# EasyEDA Pro project ProProject_PressureSensor_2023-10-08.epro, board PCB1
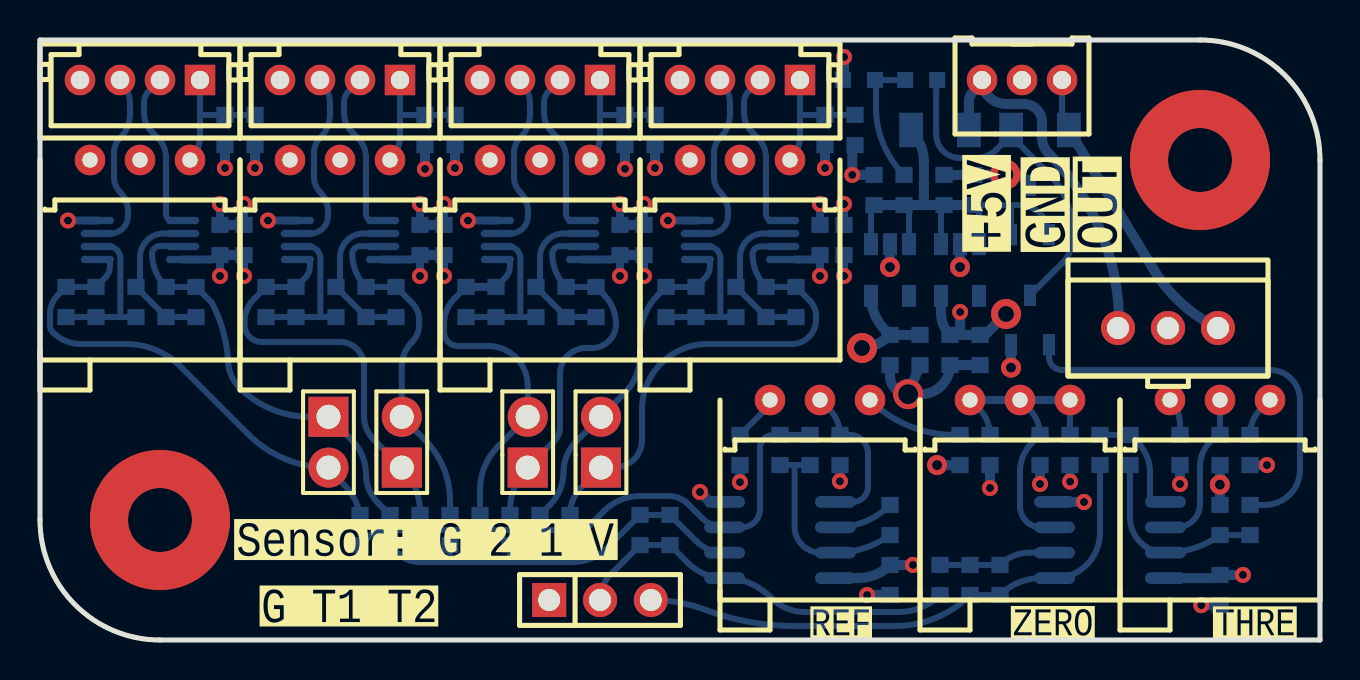
[diagram p7: board, top side]
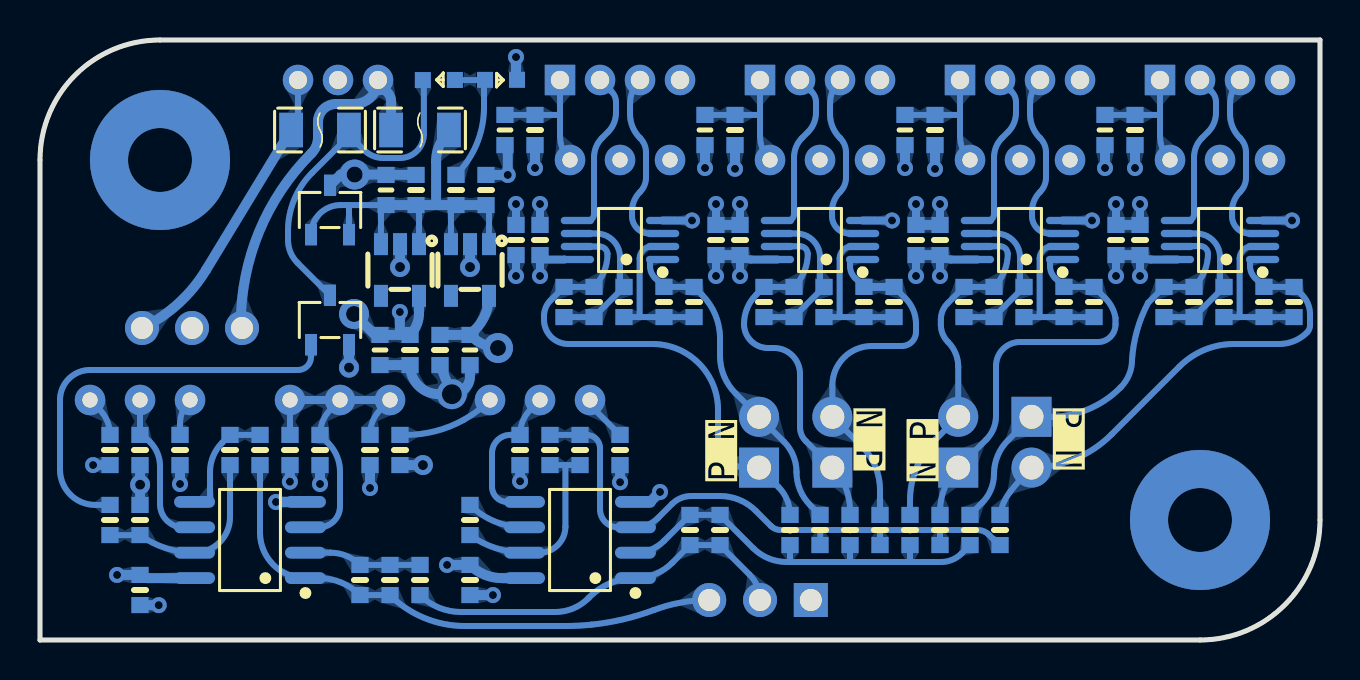
[diagram p8: board, bottom side, seen from below]

Outline 64 x 30 mm; copper layers: Top Layer, Inner1, Inner2, Bottom Layer. Coordinates in mm from the lower left corner of the outline.
Outline path: 0,6 0,30 58,30 arc(62.24,28.24) 64,24 64,0 6,0 arc(1.76,1.76) 0,6
Stack: Top Layer 0.035mm / Dielectric1 0.48mm PP er 4.5 / Inner1 0.035mm / Dielectric2 0.48mm FR4 er 4.5 / Inner2 0.035mm / Dielectric3 0.48mm PP er 4.5 / Bottom Layer 0.035mm

## Design rules (mm)
template: 自定义配置
spacing copperThickness1oz (default): track to track 0.102, other pairs 0.152 to 0.3
spacing copperThickness2oz: track to track 0.203, other pairs 0.152 to 0.3
track width copperThickness1oz (default): min 0.127, default 0.254, max 2.54
track width copperThickness2oz: min 0.203, default 0.254, max 2.54
differential pair differentialPair (default): width min 0.127, default 0.254, max 2.54; gap min 0.152, default 0.152
via viaSize (default): diameter min 0.5, default 0.61, max 10; hole min 0.3, default 0.305, max 6.3
net GND uses innerPlaneGND

## Placement (name value [footprint] x y rotation side)
C1  22uF  [R0603]  46.7 22.5 270 bottom
C2  10nF C0G  [R0603]  45.2 22.5 90 bottom
C3  1uF  [R0603]  41.7 22.5 90 bottom
C4  22uF  [R0603]  42.5 14.5 90 bottom
C5  10nF C0G  [R0603]  44 14.5 270 bottom
C7  22uF  [R0603]  47 14.5 90 bottom
C8  10nF C0G  [R0603]  45.5 14.5 270 bottom
C9  22uF  [R0603]  10.75 25.5 90 bottom
C10  100p  [R0603]  31.5 5.5 90 bottom
C11  100p  [R0603]  1.3 16.9 90 bottom
C12  100p  [R0603]  38.5 9.5 90 bottom
C13  100p  [R0603]  7.8 16.9 270 bottom
C14  100p  [R0603]  46.5 3 90 bottom
C15  100p  [R0603]  59 6 90 bottom
C16  1uF  [R0603]  40 9.5 90 bottom
C17  1uF  [R0603]  50 9.5 90 bottom
C18  1uF  [R0603]  59 9.5 90 bottom
C19  22uF  [R0603]  20.75 25.5 90 bottom
C20  100p  [R0603]  11.3 16.9 90 bottom
C21  100p  [R0603]  17.8 16.9 270 bottom
C22  10nF C0G  [R0603]  9 20 270 bottom
C23  10nF C0G  [R0603]  19 20 270 bottom
C24  10nF C0G  [R0603]  29 20 270 bottom
C25  10nF C0G  [R0603]  39 20 270 bottom
C26  10nF C0G  [R0603]  42.5 3 90 bottom
C27  10nF C0G  [R0603]  59 2.5 90 bottom
C28  22uF  [R0603]  30.75 25.5 90 bottom
C29  100p  [R0603]  21.3 16.9 90 bottom
C30  22uF  [R0603]  40.75 25.5 90 bottom
C31  100p  [R0603]  31.3 16.9 90 bottom
C32  100p  [R0603]  27.8 16.9 270 bottom
C33  100p  [R0603]  37.8 16.9 270 bottom
C34  10nF C0G  [R0603]  40.2 20 270 bottom
C35  10nF C0G  [R0603]  30.2 20 270 bottom
C36  10nF C0G  [R0603]  20.2 20 270 bottom
C37  10nF C0G  [R0603]  10.2 20 270 bottom
CN1  HDGC2001WV-4P  [CONN-TH_4P-P2.00_HDGC_HDGC2001WV-4P]  5 28 180 top
CN2  HDGC2001WV-4P  [CONN-TH_4P-P2.00_HDGC_HDGC2001WV-4P]  15 28 180 top
CN3  HDGC2001WV-4P  [CONN-TH_4P-P2.00_HDGC_HDGC2001WV-4P]  25 28 180 top
CN4  HDGC2001WV-4P  [CONN-TH_4P-P2.00_HDGC_HDGC2001WV-4P]  35 28 180 top
CN5  HC-XHB-3A  [CONN-TH_3P-P2.50_HC-XHB-3A]  56.4 15.6 0 top
F1  nSMD020-30V  [F1206]  45 25.5 180 bottom
F2  nSMD020-30V  [F1206]  50 25.5 180 bottom
H2  PZ254V-11-03P  [HDR-TH_3P-P2.54-V-M]  28 2 0 top
H5  PZ254V-11-02P  [HDR-TH_2P-P2.54-V-M]  14.42 9.89 270 top
H6  PZ254V-11-02P  [HDR-TH_2P-P2.54-V-M]  24.38 9.89 90 top
H7  PZ254V-11-02P  [HDR-TH_2P-P2.54-V-M]  28.05 9.89 90 top
H8  PZ254V-11-02P  [HDR-TH_2P-P2.54-V-M]  18.09 9.89 90 top
LED3  -  [LED_0603]  41 28 0 bottom
LED4  -  [LED_0603]  44.01 28.01 180 bottom
P1  PH-3A  [CONN-TH_12P-P2.00-H-W4.8_PH-3A]  49.1 28 270 top
Q1  S8050  [SOT-23-3_L2.9-W1.6-P1.90-LS2.8-BR]  49.5 16 270 bottom
R2  500  [R0603]  16 5.5 90 bottom
R3  15K  [R0603]  30 5.5 90 bottom
R4  500  [R0603]  19 5.5 90 bottom
R5  50  [RES-ADJ-TH_3P-L10.0-W10.0-P2.50-L]  5 24 0 top
R6  50  [R0603]  9.25 25.5 270 bottom
R7  500  [R0603]  22 5.5 90 bottom
R8  2K  [R0603]  2.8 16.9 90 bottom
R9  500  [R0603]  25 5.5 90 bottom
R10  500  [R0603]  17.5 5.5 90 bottom
R11  120  [R0603]  4.8 16.9 270 bottom
R12  500  [R0603]  20.5 5.5 90 bottom
R13  500  [R0603]  23.5 5.5 90 bottom
R14  2K  [R0603]  45 3 90 bottom
R15  2K  [R0603]  6.3 16.9 270 bottom
R16  500  [R0603]  26.5 5.5 90 bottom
R17  15K  [R0603]  37 9.5 90 bottom
R18  2K  [R0603]  48 3 90 bottom
R19  2K  [R0603]  53 9.5 90 bottom
R20  50K  [R0603]  54.5 9.5 90 bottom
R21  2K  [R0603]  46 9.5 270 bottom
R22  2K  [R0603]  42.5 6 90 bottom
R23  15K  [R0603]  51.5 9.5 270 bottom
R24  10K  [R0603]  60.5 9.5 270 bottom
R25  10K  [RES-ADJ-TH_3P-L10.0-W10.0-P2.50-L]  39 12 0 top
R26  10K  [RES-ADJ-TH_3P-L10.0-W10.0-P2.50-L]  49 12 0 top
R27  10K  [RES-ADJ-TH_3P-L10.0-W10.0-P2.50-L]  59 12 0 top
R28  5K  [R0603]  60.5 6 270 bottom
R29  2K  [R0603]  35 9.5 90 bottom
R30  5K  [R0603]  47.5 9.5 90 bottom
R31  10K  [R0603]  57 9.5 90 bottom
R33  50  [RES-ADJ-TH_3P-L10.0-W10.0-P2.50-L]  15 24 0 top
R34  50  [R0603]  19.25 25.5 270 bottom
R35  2K  [R0603]  12.8 16.9 90 bottom
R36  120  [R0603]  14.8 16.9 270 bottom
R37  2K  [R0603]  16.3 16.9 270 bottom
R38  50  [RES-ADJ-TH_3P-L10.0-W10.0-P2.50-L]  25 24 0 top
R39  50  [R0603]  29.25 25.5 270 bottom
R40  50  [RES-ADJ-TH_3P-L10.0-W10.0-P2.50-L]  35 24 0 top
R41  2K  [R0603]  22.8 16.9 90 bottom
R42  50  [R0603]  39.25 25.5 270 bottom
R43  2K  [R0603]  32.8 16.9 90 bottom
R44  120  [R0603]  24.8 16.9 270 bottom
R45  120  [R0603]  34.8 16.9 270 bottom
R46  2K  [R0603]  26.3 16.9 270 bottom
R47  2K  [R0603]  36.3 16.9 270 bottom
R48  10K  [R0603]  43.2 22.5 270 bottom
TV1  ESDA5V3L  [SOT-23-3_L2.9-W1.6-P1.90-LS2.8-BR]  49.5 21.5 270 bottom
U1  LP5907MFX-4.5/NOPB  [TSOT-23-5_L2.9-W1.6-P0.95-LS2.8-BR]  42.5 18.5 90 bottom
U2  LP5907MFX-4.5/NOPB  [TSOT-23-5_L2.9-W1.6-P0.95-LS2.8-BR]  46 18.5 90 bottom
U3  TLV2333IDGKR  [VSSOP-8_L3.0-W3.0-P0.65-LS5.0-BL]  5 20 90 bottom
U4  TLV2333IDGKR  [SOIC-8_L4.9-W3.9-P1.27-LS6.0-BL]  37 5 90 bottom
U5  TLV2333IDGKR  [SOIC-8_L4.9-W3.9-P1.27-LS6.0-BL]  53.5 5 90 bottom
U6  TLV2333IDGKR  [VSSOP-8_L3.0-W3.0-P0.65-LS5.0-BL]  15 20 90 bottom
U7  TLV2333IDGKR  [VSSOP-8_L3.0-W3.0-P0.65-LS5.0-BL]  25 20 90 bottom
U8  TLV2333IDGKR  [VSSOP-8_L3.0-W3.0-P0.65-LS5.0-BL]  35 20 90 bottom

## Footprints (pads in the part's own frame, mm; a bottom-side part is the same pattern mirrored in y, then rotated)
CONN-TH_3P-P2.50_HC-XHB-3A
  round 1.7 hole 1.1: 1(-2.5,0) 2(0,0) 3(2.5,0)
CONN-TH_4P-P2.00_HDGC_HDGC2001WV-4P
  rect 1.524x1.524 hole 0.914: 1(-3,0)
  round 1.524 hole 0.914: 2(-1,0) 3(1,0) 4(3,0)
CONN-TH_12P-P2.00-H-W4.8_PH-3A
  round 1.524 hole 0.9: 1(0,2) 2(0,0) 3(0,-2)
F1206
  rect 1.19x1.728 smd: 1(-1.445,0) 2(1.445,0)
HDR-TH_2P-P2.54-V-M
  rect 2x2 hole 1.2: 1(-1.27,0)
  round 2 hole 1.2: 2(1.27,0)
HDR-TH_3P-P2.54-V-M
  rect 1.7x1.7 hole 1.1: 1(-2.54,0)
  round 1.7 hole 1.1: 2(0,0) 3(2.54,0)
LED_0603
  rect 0.8x0.8 smd: 1(-0.851,-0.01) 2(0.75,-0.005)
R0603
  rect 0.806x0.864 smd: 1(-0.753,0) 2(0.753,0)
RES-ADJ-TH_3P-L10.0-W10.0-P2.50-L
  round 1.524 hole 0.762: 1(-2.5,0) 2(0,0) 3(2.5,0)
SOIC-8_L4.9-W3.9-P1.27-LS6.0-BL
  oval 0.588x2.045 smd: 1(-1.905,-2.772) 2(-0.635,-2.772) 3(0.635,-2.772) 4(1.905,-2.772) 5(1.905,2.772) 6(0.635,2.772) 7(-0.635,2.772) 8(-1.905,2.772)
SOT-23-3_L2.9-W1.6-P1.90-LS2.8-BR
  rect 1.07x0.6 smd: 1(1.235,-0.95) 2(1.235,0.95) 3(-1.235,0)
TSOT-23-5_L2.9-W1.6-P0.95-LS2.8-BR
  rect 1.1x0.7 smd: 1(1.294,-0.951) 2(1.294,-0.001) 3(1.294,0.951) 4(-1.294,0.951) 5(-1.294,-0.949)
VSSOP-8_L3.0-W3.0-P0.65-LS5.0-BL
  oval 0.364x1.662 smd: 1(-0.975,-2.131) 2(-0.325,-2.131) 3(0.325,-2.131) 4(0.975,-2.131) 5(0.975,2.131) 6(0.325,2.131) 7(-0.325,2.131) 8(-0.975,2.131)

## Nets
As in the schematic, except:
$1N32985: R24.1 R27.3
$1N32987: R27.1 R31.2
$1N32997: C18.2 R27.2 U5.6

Pads without a net: U1 4; U2 4

## Via types
v1: diameter 7, hole 3.2, Top Layer to Bottom Layer, 2 vias
v2: diameter 0.8, hole 0.4, Top Layer to Bottom Layer, 43 vias
v3: diameter 1, hole 0.5, Top Layer to Bottom Layer, 5 vias
v4: diameter 1.5, hole 0.8, Top Layer to Bottom Layer, 3 vias
v5: diameter 1.5, hole 1, Top Layer to Bottom Layer, 1 via

## Routing (per net, layer and track width the routed paths; a pad name or vN(x,y) marks a point on that pad's centre or on a via; arc(x,y) is an arc through that point)
GND: length 52.5
  Bottom Layer w0.4: v2(30.2,21.8) C35.1 ; v2(39,21.8) C25.1 ; v2(19,21.8) C23.1 ; v2(1.4,20.97) U3.4 ; v2(10.2,21.8) C37.1 ; v2(29,21.8) C24.1 ; v2(11.4,20.97) U6.4 ; v2(20.2,21.8) C36.1 ; v2(40.2,21.8) C34.1 ; v2(9,21.8) C22.1 ; v2(31.4,20.97) U8.4 ; v2(21.4,20.97) U7.4
  Bottom Layer w0.5: C28.1 v2(30.75,23.6) ; C15.2 59,6.76 v3(59,7.76) 59,8.74 C18.1 ; v2(58.06,1.74) 58.91,1.74 58.95,1.7 ; C7.1 C8.2 arc(45.07,12.72) 44.04,12.29 v5(43.41,12.29) ; U1.2 v3(42.5,18.65) ; C9.1 v2(10.75,23.6) ; v2(50,7.8) C17.1 ; C24.1 C35.1 ; C4.1 42.5,13.2 arc(42.77,12.56) v5(43.41,12.29) ; C23.1 C36.1 ; 40,8.7 40,8.7 v2(40,7.94) ; C26.1 v2(41.35,2.25) ; C5.2 v5(43.41,12.29) ; U5.4 50.73,6.9 v2(52.2,6.9) ; v2(33,7.4) 33.5,6.9 34.22,6.9 U4.4 ; Q1.2 v3(48.55,13.62) ; v2(57,7.8) R31.1 ; 40.2,28 v2(40.2,29.15) ; v2(47.5,7.6) R30.1 ; C22.1 C37.1 ; TV1.3 48.96,23.27 v4(48.27,23.27) C2.2 ; v2(35,7.89) 35,8.65 ; C19.1 v2(20.75,23.6) ; C3.2 v2(40.61,23.25) 40.61,24.61 C30.1 ; U2.2 v3(46,18.65)
VCC: length 32.1
  Bottom Layer w0.4: v2(19,18.2) C23.2 arc(18.75,19.08) 18.46,19.03 U6.8 ; U7.8 28.46,19.03 arc(28.75,19.08) C24.2 v2(29,18.2) ; U3.8 8.46,19.03 arc(8.75,19.08) C22.2 v2(9,18.2) ; v2(10.2,18.2) C37.2 ; v2(30.2,18.2) C35.2 ; 38.87,19.03 37.78,19.03 ; v2(20.2,18.2) C36.2 ; v2(39,18.2) C25.2 ; v2(40.2,18.2) C34.2
  Bottom Layer w0.5: C4.2 42.26,15.49 arc(41.74,16.28) U1.5 ; C4.2 C5.1 ; C4.2 42.47,15.23 arc(41.84,14.79) v4(41.1,14.6) ; C24.2 C35.2 ; U4.8 40.91,3.09 arc(41.77,3.27) C26.2 v2(43.65,3.75) ; C23.2 C36.2 ; v2(60.15,3.25) C27.2 arc(58.82,3.14) 58.62,3.09 U5.8 ; C37.2 C22.2
VCCREF: length 13.8
  Bottom Layer w0.5: R6.2 v2(9.25,23.6) ; R21.2 v3(44.85,8.75) ; 19.25,24.7 v2(19.25,23.55) ; 46.01,15.25 v2(46.01,16.4) ; v2(61.35,8.75) R24.2 ; R42.2 v2(39.25,23.6) ; v2(51.51,7.92) 51.51,8.69 51.5,8.7 ; U2.5 45.05,16.34 arc(45.17,15.75) C8.1 C7.2 47.25,15.25 v4(48.3,16.3) ; 29.25,24.7 v2(29.25,23.56)
(no net):
  vias: v1(6,6) v1(58,24)
N1: length 25.4
  Bottom Layer w0.3: R8.2 2.88,17.74 ; 2.88,17.74 3.25,18.11 arc(3.44,18.38) 3.5,18.7 3.5,19.03 U3.1 ; 2.88,17.74 arc(2.79,17.68) 2.68,17.65 C11.2 0.89,17.24 arc(0.6,16.81) 0.5,16.3 0.5,15.73 arc(0.54,15.54) 0.65,15.38 arc(1.29,14.95) 2.04,14.8 4.3,14.8 arc(5.78,14.51) 7.03,13.67 10.42,10.28 arc(12.26,9.05) H5.2 arc(14.98,8.03) 15.5,7.4 arc(15.82,6.86) R2.2
N2: length 21.5
  Bottom Layer w0.3: R4.2 19,6.42 arc(18.76,7.61) H8.1 16.69,10.02 arc(16.33,10.56) 16.2,11.2 16.2,13.7 arc(15.85,14.55) 15,14.9 11.1,14.9 arc(10.48,15.16) 10.23,15.77 10.23,16.1 arc(10.4,16.63) 10.73,17.09 C20.2 R35.2 ; U6.1 13.5,19.03 13.5,18.7 arc(13.44,18.38) 13.25,18.11 12.88,17.74
N3: length 19.3
  Bottom Layer w0.3: C29.2 20.73,17.09 arc(20.34,16.5) 20.2,15.8 20.2,15.4 arc(20.41,14.91) 20.9,14.7 22.41,14.7 arc(23.8,14.12) 24.38,12.72 H6.2 22.9,9.68 arc(22.23,8.68) 22,7.5 R7.2 ; 22.88,17.74 23.25,18.11 arc(23.44,18.38) 23.5,18.7 23.5,19.03 U7.1
  Bottom Layer w0.4: C29.2 R41.2
N4: length 17.2
  Bottom Layer w0.3: R43.2 C31.2 30.9,17.25 arc(30.23,16.26) 30,15.09 30,14.2 arc(29.8,13.19) 29.23,12.34 H7.2 26.8,9.92 arc(26.34,9.22) 26.18,8.4 arc(26,7.5) 25.49,6.74 R9.2 ; 32.88,17.74 33.25,18.11 arc(33.44,18.38) 33.5,18.7 33.5,19.03 U8.1
OUTPUT: length 17.8
  Bottom Layer w0.3: Q1.3 51.13,18.86 arc(51.48,19.39) 51.6,20 51.6,20.46 arc(51.29,22.03) 50.4,23.36 48.56,25.2 F2.2 ; 44.81,28 44.81,25.29 arc(45.16,24.45) 46,24.1 46.83,24.1 arc(47.36,24.2) 47.8,24.5 48.38,25.08 arc(48.51,25.22) 48.56,25.4
P1: length 21.9
  Bottom Layer w0.3: R15.1 7.6,17.65 7.8,17.45 ; R15.1 6.29,17.66 arc(5.78,18.43) 5.6,19.33 arc(5.72,19.59) 5.98,19.7 7.11,19.7 arc(7.12,19.69) U3.7 ; R15.1 6.48,17.47 ; R10.2 16.9,6.85 arc(16.46,7.52) 16.3,8.3 arc(16.12,9.21) 15.6,9.98 H5.1 13.48,11.16 arc(11.6,11.53) 10,12.6 9.97,12.63 arc(9.55,13.26) 9.4,14 arc(9.15,15.47) 8.6,16.86 C13.1
P2: length 18.1
  Bottom Layer w0.3: R37.1 17.6,17.65 17.8,17.45 ; R37.1 16.31,17.64 ; R37.1 arc(15.79,18.42) 15.61,19.32 arc(15.73,19.58) 15.99,19.69 17.12,19.69 arc(17.12,19.69) 17.13,19.69 ; C21.1 18.62,16.83 arc(18.87,16.46) 18.96,16.02 18.96,15.76 arc(18.86,15.3) 18.6,14.9 arc(18.22,14.33) 18.09,13.66 H8.2 19.25,10 arc(20.17,8.61) 20.5,6.97 R12.2 ; 17.13,19.69 arc(17.14,19.68) 17.14,19.67 ; 17.13,19.69 arc(17.13,19.68) U6.7 ; 17.13,19.69 arc(17.12,19.7) 17.11,19.7
P3: length 19.3
  Bottom Layer w0.3: 26.5,17.65 C32.1 28.2,17.26 arc(28.64,16.59) 28.8,15.8 arc(28.45,14.95) 27.6,14.6 27.3,14.6 arc(26.38,14.22) 26,13.3 26,10.64 arc(25.93,10.27) 25.72,9.95 H6.1 arc(23.73,7.64) 23.5,6.49 R13.2 ; 26.31,17.65 26.31,17.64 R46.1 arc(25.79,18.42) 25.61,19.32 arc(25.73,19.58) 25.99,19.69 27.12,19.69 arc(27.12,19.69) 27.13,19.69 ; 27.11,19.7 arc(27.12,19.7) 27.13,19.69 ; 27.13,19.69 arc(27.14,19.68) 27.14,19.67 ; 27.13,19.69 arc(27.13,19.68) U7.7
P4: length 26
  Bottom Layer w0.3: R47.1 36.31,17.64 ; 36.31,17.64 36.31,17.65 ; 36.31,17.64 36.32,17.63 ; 36.31,17.64 arc(35.8,18.4) 35.63,19.3 arc(35.74,19.56) 36.01,19.67 U8.7 arc(37.15,19.67) 37.16,19.65 ; H7.1 28.72,8.62 arc(29.7,9.02) 30.1,10 30.1,11.52 arc(31.06,13.84) 33.38,14.8 37.59,14.8 arc(38.45,15.15) 38.8,16.01 38.8,16.2 arc(38.72,16.62) 38.48,16.97 C33.1 36.5,17.65 ; H7.1 27.08,7.65 arc(26.65,7.01) R16.2 ; H7.1 arc(28.3,8.67) 28.51,8.81
$1N30553: length 9.4
  Bottom Layer w0.3: U3.3 3.53,20.33 arc(4.14,20.58) 4.4,21.2 4.4,21.43 arc(4.3,21.96) 4,22.4 arc(3.78,22.73) 3.7,23.12 3.7,24.38 arc(3.78,24.77) 4,25.1 4,25.11 arc(4.37,25.65) 4.5,26.3 4.5,26.79 arc(4.37,27.45) CN1.3
$1N30561: length 8.4
  Bottom Layer w0.3: U3.5 6.61,20.97 arc(6.39,21.07) 6.3,21.29 6.3,24.13 arc(6.2,24.66) 5.9,25.1 5.6,25.4 arc(5.3,25.84) 5.2,26.37 5.2,26.9 arc(5.26,27.18) 5.41,27.41 CN1.2
$1N30605: length 7.9
  Bottom Layer w0.3: 4.02,16.15 R8.1 C11.1 ; 4.02,16.15 4.02,19.08 arc(3.84,19.5) 3.42,19.67 U3.2 ; 4.02,16.15 R11.2
$1N30608: length 8.1
  Bottom Layer w0.3: R11.1 4.92,17.53 ; 4.92,17.53 6.3,16.16 arc(6.3,16.15) R15.2 C13.2 ; 4.92,17.53 arc(4.98,17.55) 5,17.61 5,19.13 arc(5.35,19.98) 6.19,20.33 U3.6
$1N32010: length 5
  Bottom Layer w0.3: R21.1 45.72,10.25 arc(44.21,10.45) 42.81,11.01 arc(42.12,11.46) R25.3
$1N32012: length 2.3
  Bottom Layer w0.3: R29.2 36.33,11.58 arc(36.45,11.77) R25.1
$1N32045: length 7.7
  Bottom Layer w0.3: R25.2 39.47,11.53 arc(39.86,10.94) C16.2 40.48,10.25 arc(41.13,9.99) 41.4,9.34 41.4,7.66 arc(41.18,7.13) 40.64,6.91 U4.5
$1N32103: length 3
  Bottom Layer w0.3: R22.2 arc(41.25,5.92) U4.6
$1N32162: length 21.1
  Bottom Layer w0.3: R12.1 20.5,3.91 arc(20.5,3.9) 20.5,3.9 ; 26.47,3.9 26.66,3.9 arc(27.57,4.08) 28.34,4.6 R3.2 C10.2 ; 26.47,3.9 23.51,3.9 ; 26.47,3.9 arc(26.49,3.94) 26.5,3.98 R16.1 ; U4.2 34.22,4.36 arc(33.45,4.52) 32.8,4.95 31.5,6.25 ; 20.5,3.9 23.51,3.9 ; 20.5,3.9 18.95,3.9 arc(18.39,4.01) 17.92,4.32 R10.1 ; 23.51,3.9 arc(23.5,3.91) 23.5,3.92 R13.1
$1N32193: length 10.3
  Bottom Layer w0.3: 37.73,8.75 37.73,5.67 arc(38.11,4.75) 39.03,4.36 U4.7 arc(41.21,4.59) R22.1 ; 37.73,8.75 C12.1 ; 37.73,8.75 R17.1
$1N32196: length 29.8
  Bottom Layer w0.3: C12.2 R17.2 36.66,10.25 arc(36.19,10.06) 36,9.59 36,6.54 arc(35.74,5.9) 35.1,5.64 U4.3 arc(33.62,5.76) 33.1,6.1 32.4,6.8 arc(31.96,7.1) 31.43,7.2 30,7.2 arc(29.03,7.01) 28.21,6.46 27.45,5.7 arc(27.23,5.55) 26.97,5.5 24.99,5.5 ; 19,5.5 17.11,5.5 arc(16.82,5.44) 16.57,5.28 16.31,5.01 16.28,5.03 ; 19,5.5 22.01,5.5 ; 19,5.5 arc(19,5.5) 19,5.5 R4.1 ; 22.01,5.5 24.99,5.5 ; 22.01,5.5 arc(22,5.48) 22,5.47 R7.1 ; 24.99,5.5 24.99,4.78 arc(24.99,4.76) R9.1 ; 20.5,5.47 arc(20.5,5.49) 20.51,5.5 ; 26.5,5.45 arc(26.5,5.48) 26.52,5.5 ; 23.5,5.48 arc(23.5,5.49) 23.51,5.5
$1N32985: length 2.1
  Bottom Layer w0.3: R27.3 61.03,11.53 arc(60.64,10.94) R24.1
$1N32987: length 1.9
  Bottom Layer w0.3: R31.2 57,10.79 arc(56.87,11.45) R27.1
$1N32997: length 8
  Bottom Layer w0.3: U5.6 56.84,5.64 arc(57.66,5.98) 58,6.8 58,8.69 arc(58.13,9.35) 58.5,9.9 58.75,10.15 arc(58.86,10.23) C18.2 R27.2
$1N33007: length 5.9
  Bottom Layer w0.3: U5.5 55.5,6.91 55.5,8.4 arc(55.34,9.19) 54.9,9.86 R20.2 R19.2
$1N33240: length 21.4
  Bottom Layer w0.3: Q1.1 50.45,14.15 arc(50.64,13.69) 51.1,13.5 61.5,13.5 arc(62.56,13.06) 63,12 63,8.52 arc(62.48,7.27) 61.24,6.75 R28.1
$1N33276: length 9.8
  Bottom Layer w0.3: R20.1 54.5,6.14 arc(55.02,4.88) U5.7 arc(57.71,4.59) C15.1 arc(59.75,5.25) 60.5,5.24
$1N35532: length 19.8
  Bottom Layer w0.3: C10.1 R3.1 28.53,3.27 arc(28.14,2.69) H2.2 ; 31.5,4.75 32.39,3.86 arc(33.23,3.29) U4.1 arc(35.47,2.85) 36.53,2.14 36.59,2.08 arc(37.34,1.58) 38.23,1.4 42.96,1.4 arc(44.06,1.62) R14.1
$1N36334: length 27.9
  Bottom Layer w0.3: R19.1 53,5.37 arc(52.33,3.76) U5.1 50.05,3.09 arc(48.94,2.87) R18.1 C14.1 arc(44.79,1.1) 42.77,0.7 37.68,0.7 arc(37.06,0.72) 36.44,0.77 arc(34.84,1.03) 33.3,1.5 arc(31.94,1.87) H2.3
$1N36352: length 5.9
  Bottom Layer w0.3: U5.2 49.48,4.36 arc(48.68,4.21) R18.2 C14.2 R14.2
$1N36780: length 9.4
  Bottom Layer w0.3: U6.3 13.53,20.33 arc(14.14,20.58) 14.4,21.2 14.4,21.43 arc(14.3,21.96) 14,22.4 arc(13.78,22.73) 13.7,23.12 13.7,24.38 arc(13.78,24.77) 14,25.1 14,25.11 arc(14.37,25.65) 14.5,26.3 14.5,26.79 arc(14.37,27.45) CN2.3
$1N36784: length 8.4
  Bottom Layer w0.3: U6.5 16.61,20.97 arc(16.39,21.07) 16.3,21.29 16.3,24.13 arc(16.2,24.66) 15.9,25.1 15.6,25.4 arc(15.3,25.84) 15.2,26.37 15.2,26.9 arc(15.26,27.18) 15.41,27.41 CN2.2
$1N36792: length 7.9
  Bottom Layer w0.3: U6.2 13.43,19.67 arc(13.84,19.5) 14.02,19.08 14.02,16.15 ; R36.2 R35.1 C20.1
$1N36797: length 8.1
  Bottom Layer w0.3: R36.1 14.92,17.53 ; 14.92,17.53 16.29,16.16 arc(16.3,16.15) R37.2 C21.2 ; 14.92,17.53 arc(14.98,17.55) 15,17.61 15,19.13 arc(15.35,19.98) 16.19,20.33 U6.6
$1N37205: length 9.4
  Bottom Layer w0.3: U7.3 23.53,20.33 arc(24.14,20.58) 24.4,21.2 24.4,21.43 arc(24.3,21.96) 24,22.4 arc(23.78,22.73) 23.7,23.12 23.7,24.38 arc(23.78,24.77) 24,25.1 24,25.11 arc(24.37,25.65) 24.5,26.3 24.5,26.79 arc(24.37,27.45) CN3.3
$1N37209: length 8.4
  Bottom Layer w0.3: CN3.2 25.41,27.41 arc(25.26,27.18) 25.2,26.9 25.2,26.37 arc(25.3,25.84) 25.6,25.4 25.9,25.1 arc(26.2,24.66) 26.3,24.13 26.3,21.29 arc(26.39,21.07) 26.61,20.97 U7.5
$1N37217: length 7.9
  Bottom Layer w0.3: R44.2 R41.1 C29.1 ; 24.02,16.15 24.02,19.08 arc(23.84,19.5) 23.43,19.67 U7.2
$1N37222: length 8.1
  Bottom Layer w0.3: 24.92,17.53 26.3,16.16 arc(26.3,16.15) R46.2 C32.2 ; 24.92,17.53 R44.1 ; 24.92,17.53 arc(24.98,17.55) 25,17.61 25,19.13 arc(25.35,19.98) 26.19,20.33 U7.6
$1N37630: length 9.4
  Bottom Layer w0.3: U8.3 33.53,20.33 arc(34.14,20.58) 34.4,21.2 34.4,21.43 arc(34.3,21.96) 34,22.4 arc(33.78,22.73) 33.7,23.12 33.7,24.38 arc(33.78,24.77) 34,25.1 34,25.11 arc(34.37,25.65) 34.5,26.3 34.5,26.79 arc(34.37,27.45) CN4.3
$1N37634: length 8.4
  Bottom Layer w0.3: CN4.2 35.41,27.41 arc(35.26,27.18) 35.2,26.9 35.2,26.37 arc(35.3,25.84) 35.6,25.4 35.9,25.1 arc(36.2,24.66) 36.3,24.13 36.3,21.29 arc(36.39,21.07) 36.61,20.97 U8.5
$1N37642: length 7.9
  Bottom Layer w0.3: C31.1 R43.1 R45.2 ; 34.02,16.15 34.02,19.08 arc(33.84,19.5) 33.43,19.67 U8.2
$1N37647: length 8.1
  Bottom Layer w0.3: U8.6 36.19,20.33 arc(35.35,19.98) 35,19.13 35,17.61 arc(34.98,17.55) 34.92,17.53 ; C33.2 R47.2 arc(36.3,16.15) 36.3,16.16 34.92,17.53 ; 34.92,17.53 R45.1
$1N37723: length 6.8
  Bottom Layer w0.3: C19.2 R34.1 18.06,26.25 ; CN2.1 18,25.21 arc(17.87,24.55) R33.3
$1N37747: length 6.8
  Bottom Layer w0.3: CN3.1 28,25.21 arc(27.87,24.55) R38.3 ; C28.2 R39.1 28.06,26.25
$1N37752: length 6.9
  Bottom Layer w0.3: C9.2 R6.1 8.06,26.25 arc(8.03,26.25) 8,26.23 ; 8,26.23 8,25.21 arc(7.87,24.55) R5.3 ; 8,26.23 CN1.1
$1N37762: length 6.8
  Bottom Layer w0.3: C30.2 R42.1 38.06,26.25 ; CN4.1 38,25.21 arc(37.87,24.55) R40.3
$1N42503: length 19
  Bottom Layer w0.5: F1.1 46.44,26.93 arc(46.64,27.39) 47.1,27.58 P1.3 arc(47.45,27.15) 48.3,26.8 49.2,26.8 arc(49.84,26.54) 50.1,25.9 50.1,25.13 arc(50.18,24.7) 50.43,24.34 arc(53.04,20.42) 53.96,15.81 53.96,15
$1N42542: length 15.8
  Bottom Layer w0.3: P1.1 51.1,26.33 arc(51.19,25.84) 51.44,25.4
  Bottom Layer w0.5: F2.1 55.7,18.5 arc(57.09,16.82) CN5.3 ; 51.44,25.4 arc(51.51,25.13) 51.69,24.91
$1N42787: length 6.5
  Bottom Layer w0.3: 43.21,28.01 arc(43.19,28) 43.18,28 41.8,28 41.8,26.63 arc(42.16,24.8) R48.1
$1N42798: length 22.9
  Bottom Layer w0.3: 48.51,21.75 48.97,21.75 arc(50.02,21.31) TV1.1 ; 48.51,21.75 46.95,21.75 ; 48.51,21.75 arc(48.54,21.74) 48.55,21.71 TV1.2 ; U2.3 46.95,21.74 arc(46.95,21.74) 46.95,21.75 ; U1.3 43.45,21.59 arc(43.47,21.67) 43.52,21.75 ; C1.2 46.95,21.75 ; U2.1 45.05,21.63 arc(45.14,21.67) C2.1 ; U1.1 41.55,21.63 arc(41.64,21.67) C3.1
  Bottom Layer w0.5: 44.19,21.75 C2.1 C1.2 ; 44.19,21.75 C3.1 ; 44.19,21.75 44.19,23.96 arc(44.03,24.75) 43.56,25.4
$1N53934: length 17.1
  Bottom Layer w0.3: U5.3 50.05,5.64 arc(49.31,5.94) 49,6.69 49,8.42 arc(49.15,9.19) 49.59,9.84 C17.2 arc(49.86,10.94) 49.47,11.53 R26.2 ; R26.3 R23.1 ; R26.1 46.97,11.53 arc(47.36,10.94) R30.2
  Bottom Layer w0.4: R26.3 R26.2 R26.1

## Copper pours and planes (outline as drawn; the poured copper is in the pictures)
GND on Top Layer: 0,30 64,30 64,0 0,0
GND on Inner2: 48.7,28.4 49.5,28.4 49.5,26.58 48.7,26.58
GND on Inner2: 31.6,28.4 32.4,28.4 32.4,26.58 31.6,26.58
GND on Inner2: 23.95,2.4 25.86,2.4 25.86,1.6 23.95,1.6
GND on Inner2: 11.6,28.4 12.4,28.4 12.4,26.58 11.6,26.58
GND on Inner2: 21.6,29.42 22.4,29.42 22.4,27.6 21.6,27.6
GND on Inner2: 56,17.11 56.8,17.11 56.8,15.2 56,15.2
GND on Inner2: 1.6,29.42 2.4,29.42 2.4,27.6 1.6,27.6
GND on Inner2: 1.6,28.4 2.4,28.4 2.4,26.58 1.6,26.58
GND on Inner2: 21.6,28.4 22.4,28.4 22.4,26.58 21.6,26.58
GND on Inner2: 20.58,28.4 22.4,28.4 22.4,27.6 20.58,27.6
GND on Inner2: 30.58,28.4 32.4,28.4 32.4,27.6 30.58,27.6
GND on Inner2: 0.58,28.4 2.4,28.4 2.4,27.6 0.58,27.6
GND on Inner2: 10.58,28.4 12.4,28.4 12.4,27.6 10.58,27.6
GND on Inner2: 25.06,2.4 25.86,2.4 25.86,0.49 25.06,0.49
GND on Inner2: 25.06,3.51 25.86,3.51 25.86,1.6 25.06,1.6
GND on Inner2: 31.6,29.42 32.4,29.42 32.4,27.6 31.6,27.6
GND on Inner2: 0.26,29.74 63.74,29.74 63.74,0.26 0.26,0.26
GND on Inner2: 56,16 56.8,16 56.8,14.09 56,14.09
GND on Inner2: 48.7,29.42 49.5,29.42 49.5,27.6 48.7,27.6
GND on Inner2: 11.6,29.42 12.4,29.42 12.4,27.6 11.6,27.6
VCC on Inner1: 0.5,21.66 63.5,21.66 63.5,0.5 0.5,0.5
VCCREF on Inner1: 0.5,29.5 63.5,29.5 63.5,6.66 0.5,6.66

Small or netless copper shapes (teardrops, artwork), in the pictures only: 398 on Bottom Layer, 32 on Inner1

## Text on the board
Bottom Silkscreen Layer: P N | N P
Top Silkscreen Layer: REF | ZERO | THRE | G T1 T2 | Sensor: G 2 1 V | +5V | GND | OUT
